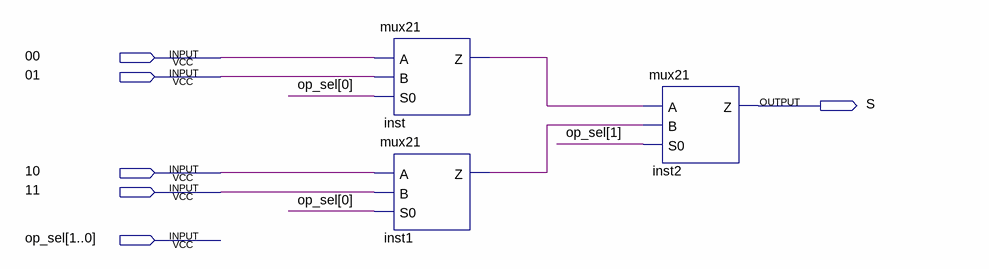
[diagram p0: schematic sheet]
// Quartus schematic mux41.bdf as structural Verilog: 3 symbols, 6 pins
module mux41 (
  input  \00 ,
  input  \01 ,
  input  \10 ,
  input  \11 ,
  input  [1:0] op_sel,
  output S
);

  wire inst1_z, inst_z;

  mux21 inst (.A(\00 ), .B(\01 ), .S0(op_sel[0]), .Z(inst_z));
  mux21 inst1 (.A(\10 ), .B(\11 ), .S0(op_sel[0]), .Z(inst1_z));
  mux21 inst2 (.A(inst_z), .B(inst1_z), .S0(op_sel[1]), .Z(S));
endmodule
